# EAGLE design KeySwitch (EAGLE 9.0.1)
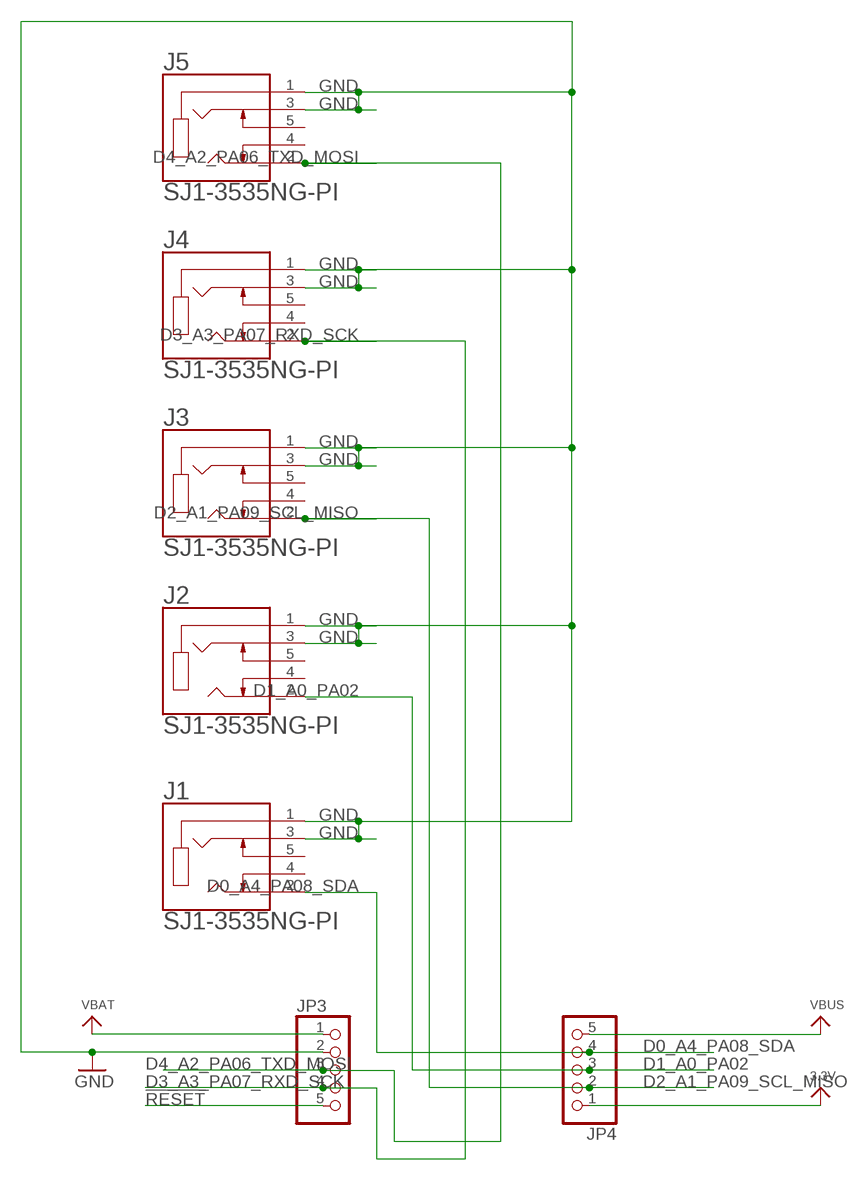
[diagram p0: schematic, sheet 1]

## Parts
J1  SJ1-3535NG-PI  [CUI_SJ1-3535NG-PI]
J2  SJ1-3535NG-PI  [CUI_SJ1-3535NG-PI]
J3  SJ1-3535NG-PI  [CUI_SJ1-3535NG-PI]
J4  SJ1-3535NG-PI  [CUI_SJ1-3535NG-PI]
J5  SJ1-3535NG-PI  [CUI_SJ1-3535NG-PI]
JP3  HEADER-1X576MIL  [1X05_ROUND_76]
JP4  HEADER-1X576MIL  [1X05_ROUND_76]

## Nets
3.3V: JP4.1
!RESET: JP3.5
D0_A4_PA08_SDA: J1.2 JP4.4
D1_A0_PA02: J2.2 JP4.3
D2_A1_PA09_SCL_MISO: J3.2 JP4.2
D3_A3_PA07_RXD_SCK: J4.2 JP3.4
D4_A2_PA06_TXD_MOSI: J5.2 JP3.3
GND: J1.1 J1.3 J2.1 J2.3 J3.1 J3.3 J4.1 J4.3 J5.1 J5.3 JP3.2
VBAT: JP3.1
VBUS: JP4.5
Unconnected: J1.4 J1.5 J2.4 J2.5 J3.4 J3.5 J4.4 J4.5 J5.4 J5.5

## Library data of the parts
J1-J5 = SJ1-3535NG-PI:SJ1-3535NG-PI: 3.5 mm Right-Angle Stereo Jack, 5 pin PCB PCB Mount, Isolated Ground, Pink; MANUFACTURER: CUI; PARTREV: 1.02; STANDARD: Manufacturer recommendation
JP3 JP4 = microbuilder:HEADER-1X5: PIN HEADER

## Board
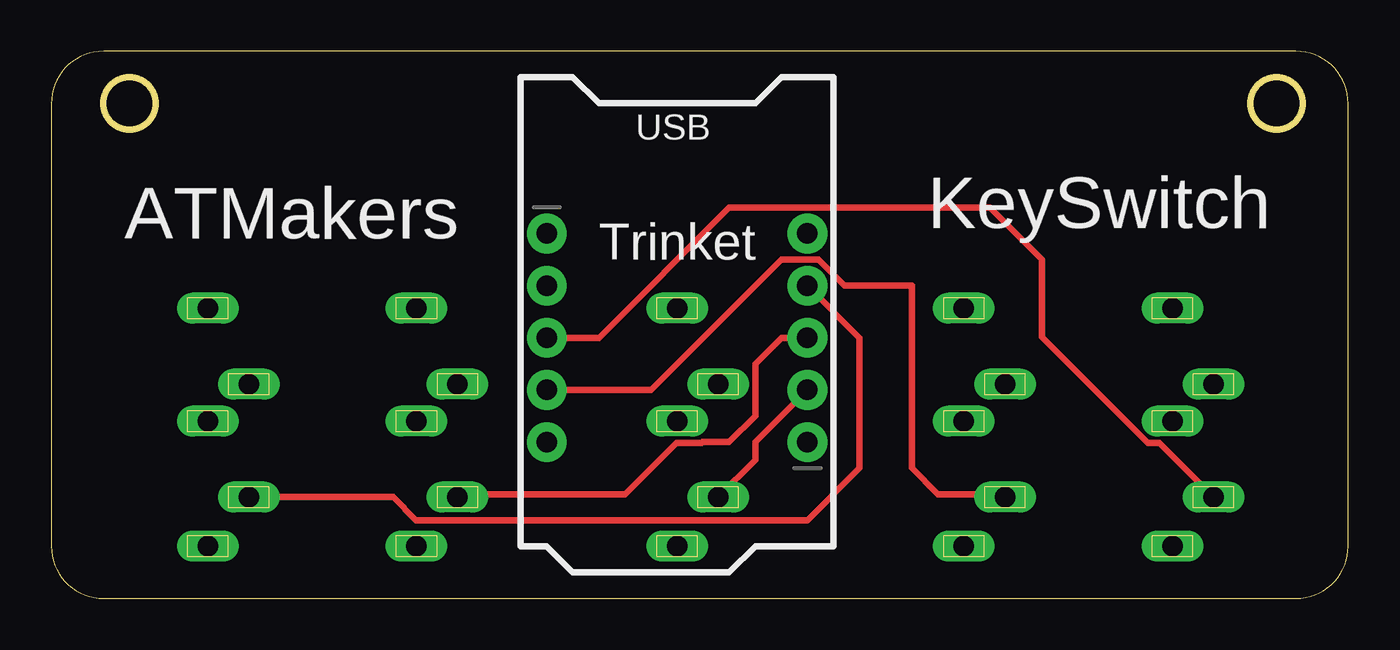
[diagram p1: board, top side]
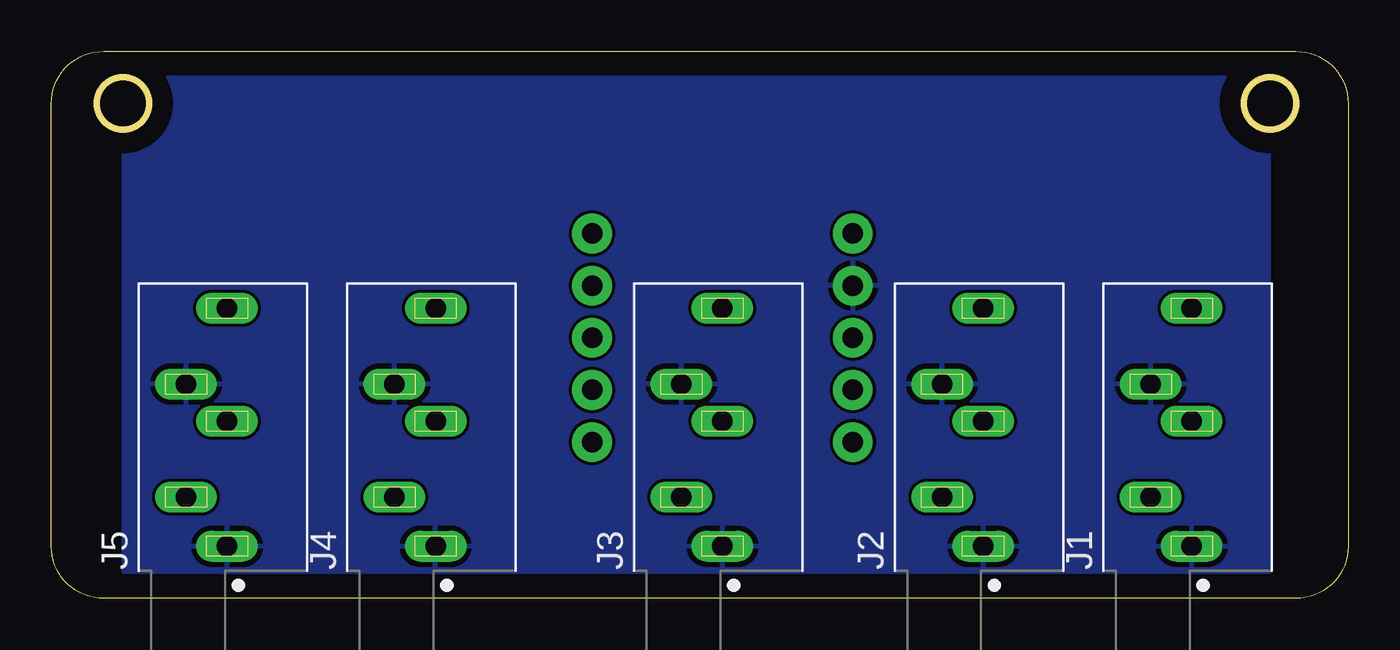
[diagram p2: board, bottom side, seen from below]

Size 63.17 x 26.66 mm. Coordinates in mm from the lower left corner, seen from the top.
Outline: 60.63,26.66 2.54,26.66 arc90 0,24.12 0,2.54 arc90 2.54,0 60.63,0 arc90 63.17,2.54 63.17,24.12 arc90 60.63,26.66
Outline: circle at 3.81,24.13 radius 1.27
Outline: circle at 59.69,24.13 radius 1.27
Copper layers (1*16): Top 0.035mm / dielectric 1.5mm / Bottom 0.035mm
Design rules "default": minimum track width 6mil, minimum drill 0.35mm, track to track 6mil, track to pad 6mil, pad to pad 6mil, via to via 6mil, smd to smd 6mil, copper to edge 40mil, drill to drill 6mil, minimum pad ring 10mil, minimum via ring 8mil, stop-mask expansion 4mil, vias tented up to drill 0mil, thermal gap 10mil

### Footprints (pad centres in the part's own frame; a part is rotated, then mirrored left to right if it is on the bottom)
CUI_SJ1-3535NG-PI = drill 1 long: 1 0,0; 2 2.4,2; 3 7.9,2; 4 11.6,0; 5 6.1,0
1X05_ROUND_76 = drill 1 pad 1.93: 1 -5.08,0; 2 -2.54,0; 3 0,0; 4 2.54,0; 5 5.08,0

### Placement (x,y rotation side)
J1  7.62,2.54 90 bottom
J2  17.78,2.54 90 bottom
J3  30.48,2.54 90 bottom
J4  44.45,2.54 90 bottom
J5  54.61,2.54 90 bottom
JP3  24.13,12.7 270 top
JP4  36.83,12.7 90 top

### Tracks (layer width: path | path; a pad name or v marks a point on that pad's centre or on a via)
D0_A4_PA08_SDA
  Top 0.305: J1.2 16.65,4.94 17.78,3.81 36.83,3.81 39.37,6.35 39.37,12.7 JP4.4
D1_A0_PA02
  Top 0.305: J2.2 19.92,5.08 27.94,5.08 30.44,7.58 31.67,7.58 31.71,7.62 33.02,7.62 34.29,8.89 34.29,10.88 34.29,11.43 35.56,12.7 JP4.3
D2_A1_PA09_SCL_MISO
  Top 0.305: J3.2 34.29,6.75 34.29,7.62 JP4.2
D3_A3_PA07_RXD_SCK
  Top 0.305: J4.2 46.31,5.08 43.18,5.08 41.91,6.35 41.91,15.24 38.63,15.24 37.36,16.51 35.56,16.51 29.21,10.16 JP3.4
D4_A2_PA06_TXD_MOSI
  Top 0.305: J5.2 53.97,7.58 53.42,7.58 48.26,12.74 48.26,16.51 45.72,19.05 33.02,19.05 26.67,12.7 JP3.3
GND
  pour Bottom: 3.81,25.4 59.69,25.4 59.69,1.27 3.81,1.27

### Text on the board
tPlace: USB | ATMakers | KeySwitch | Trinket